# EAGLE schematic Schematic (EAGLE 7.7.0)
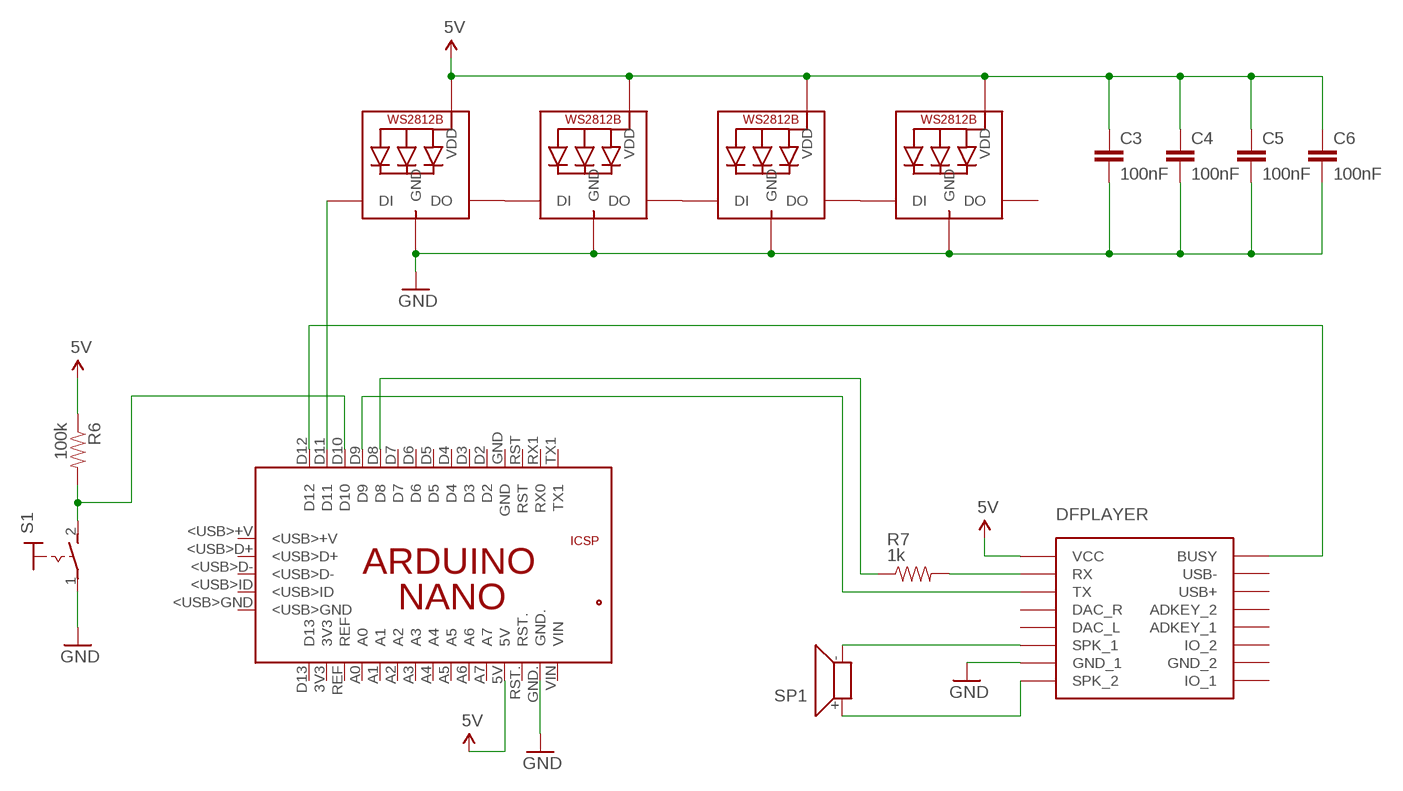
[diagram p0: schematic, sheet 1]

## Parts
C3  100nF  C-EU102-054X133  [C102-054X133]
C4  100nF  C-EU102-054X133  [C102-054X133]
C5  100nF  C-EU102-054X133  [C102-054X133]
C6  100nF  C-EU102-054X133  [C102-054X133]
LED1  WS2812B3535  [LED3535]
LED2  WS2812B3535  [LED3535]
LED3  WS2812B3535  [LED3535]
LED4  WS2812B3535  [LED3535]
PCB1  ARDUINO_NANO  [ARDUINO_NANO]
R6  100k  RESISTOR0402-RES  [0402-RES]
R7  1k  RESISTOR0402-RES  [0402-RES]
S1  MS243  [MS243]
SP1  SMS-1308MS-2-R  [SMS-1308MS-2-R]
U$8  DF  DFPLAYER  [DFPLAYER]

## Nets
5V: C3.1 C4.1 C5.1 C6.1 LED1.2(VDD) LED2.2(VDD) LED3.2(VDD) LED4.2(VDD) PCB1.5V R6.1 U$8.VCC
GND: C3.2 C4.2 C5.2 C6.2 LED1.4(GND) LED2.4(GND) LED3.4(GND) LED4.4(GND) PCB1.GND. S1.1(P) U$8.GND_1
N$1: PCB1.D12 U$8.BUSY
N$2: PCB1.D10 R6.2 S1.2(S)
N$3: PCB1.D9 U$8.TX
N$4: SP1.- U$8.SPK1(SPK_1)
N$7: SP1.+ U$8.SPK2(SPK_2)
N$13: LED1.3(DO) LED2.1(DI)
N$19: R7.2 U$8.RX
N$20: LED1.1(DI) PCB1.D11
N$21: LED2.3(DO) LED3.1(DI)
N$22: LED3.3(DO) LED4.1(DI)
N$23: PCB1.D8 R7.1
Unconnected: LED4.3(DO) PCB1.3V3 PCB1.5V. PCB1.<USB>+V PCB1.<USB>D+ PCB1.<USB>D- PCB1.<USB>GND PCB1.<USB>ID PCB1.A0 PCB1.A1 PCB1.A2 PCB1.A3 PCB1.A4 PCB1.A5 PCB1.A6 PCB1.A7 PCB1.D2 PCB1.D3 PCB1.D4 PCB1.D5 PCB1.D6 PCB1.D7 PCB1.D13 PCB1.GND PCB1.GND_ PCB1.MISO PCB1.MOSI PCB1.REF PCB1.RESET.. PCB1.RST PCB1.RST. PCB1.RX1(RX0) PCB1.SCK PCB1.TX1 PCB1.VIN U$8.ADKEY1(ADKEY_1) U$8.ADKEY2(ADKEY_2) U$8.DAC_L U$8.DAC_R U$8.GND_2 U$8.IO1(IO_1) U$8.IO2(IO_2) U$8.USB+ U$8.USB-

## Notes on the sheet
- DFPLAYER

## Library data of the parts
C3-C6 = rcl:C-EU: CAPACITOR, European symbol
LED1-LED4 = adafruit:WS2812B
PCB1 = E14_Arduino_revC:ARDUINO_NANO: Device for representing an Arduino Nano board with a footprint in an EAGLE design. Created by Dave Young for Element14. More EAGLE documentation at: http://www.element14.com/community/community/knode/cadsoft_eagle
R6 R7 = SparkFun:RESISTOR: Resistor Basic schematic elements and footprints for 0603, 1206, and PTH resistors.
S1 = switch:MS243: TOGGLE SWITCH
SP1 = speaker:SMS-1308MS-2-R: Speaker 13 x 13mm, 8 Ohm, 0.7W Source: pui audio inc. SMS-1308MS-2-R.pdf
U$8 = DFPlayer_v1:DFPLAYER